# EasyEDA Pro project ProPrj_stmf4+esp32s3转接板_2025-01-29.epro, board PCB2
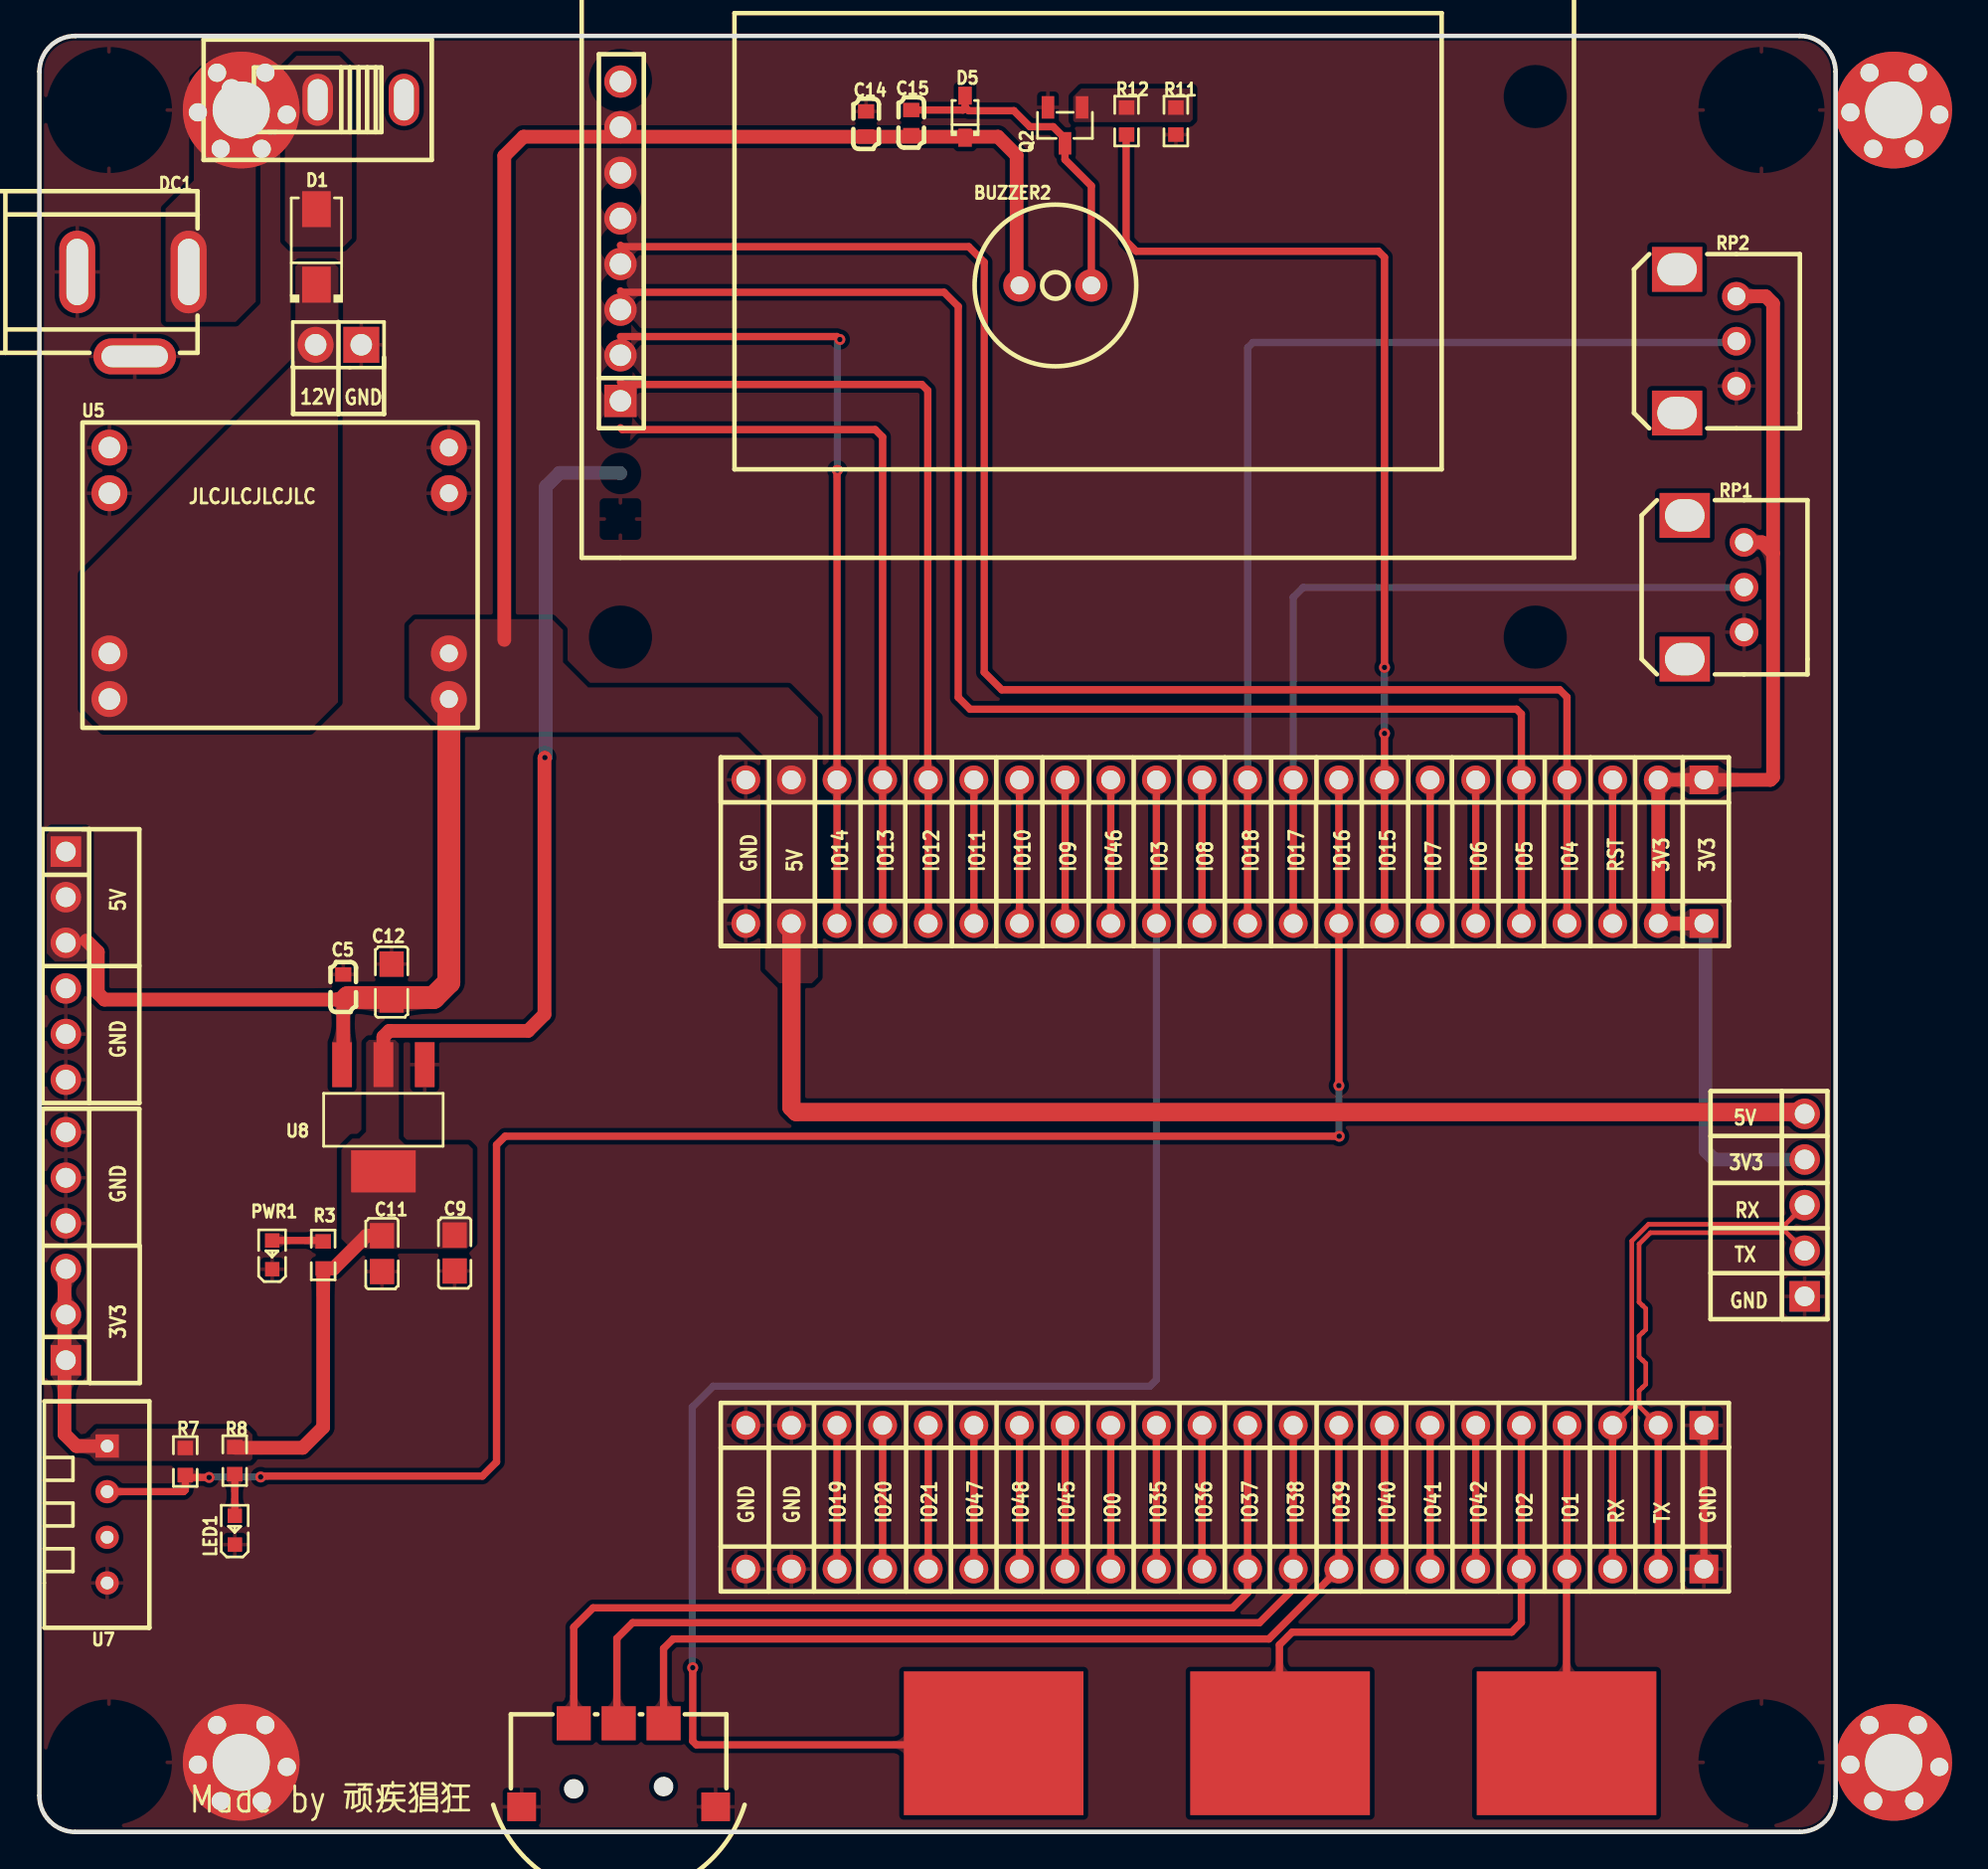
[diagram p4: board, top side]
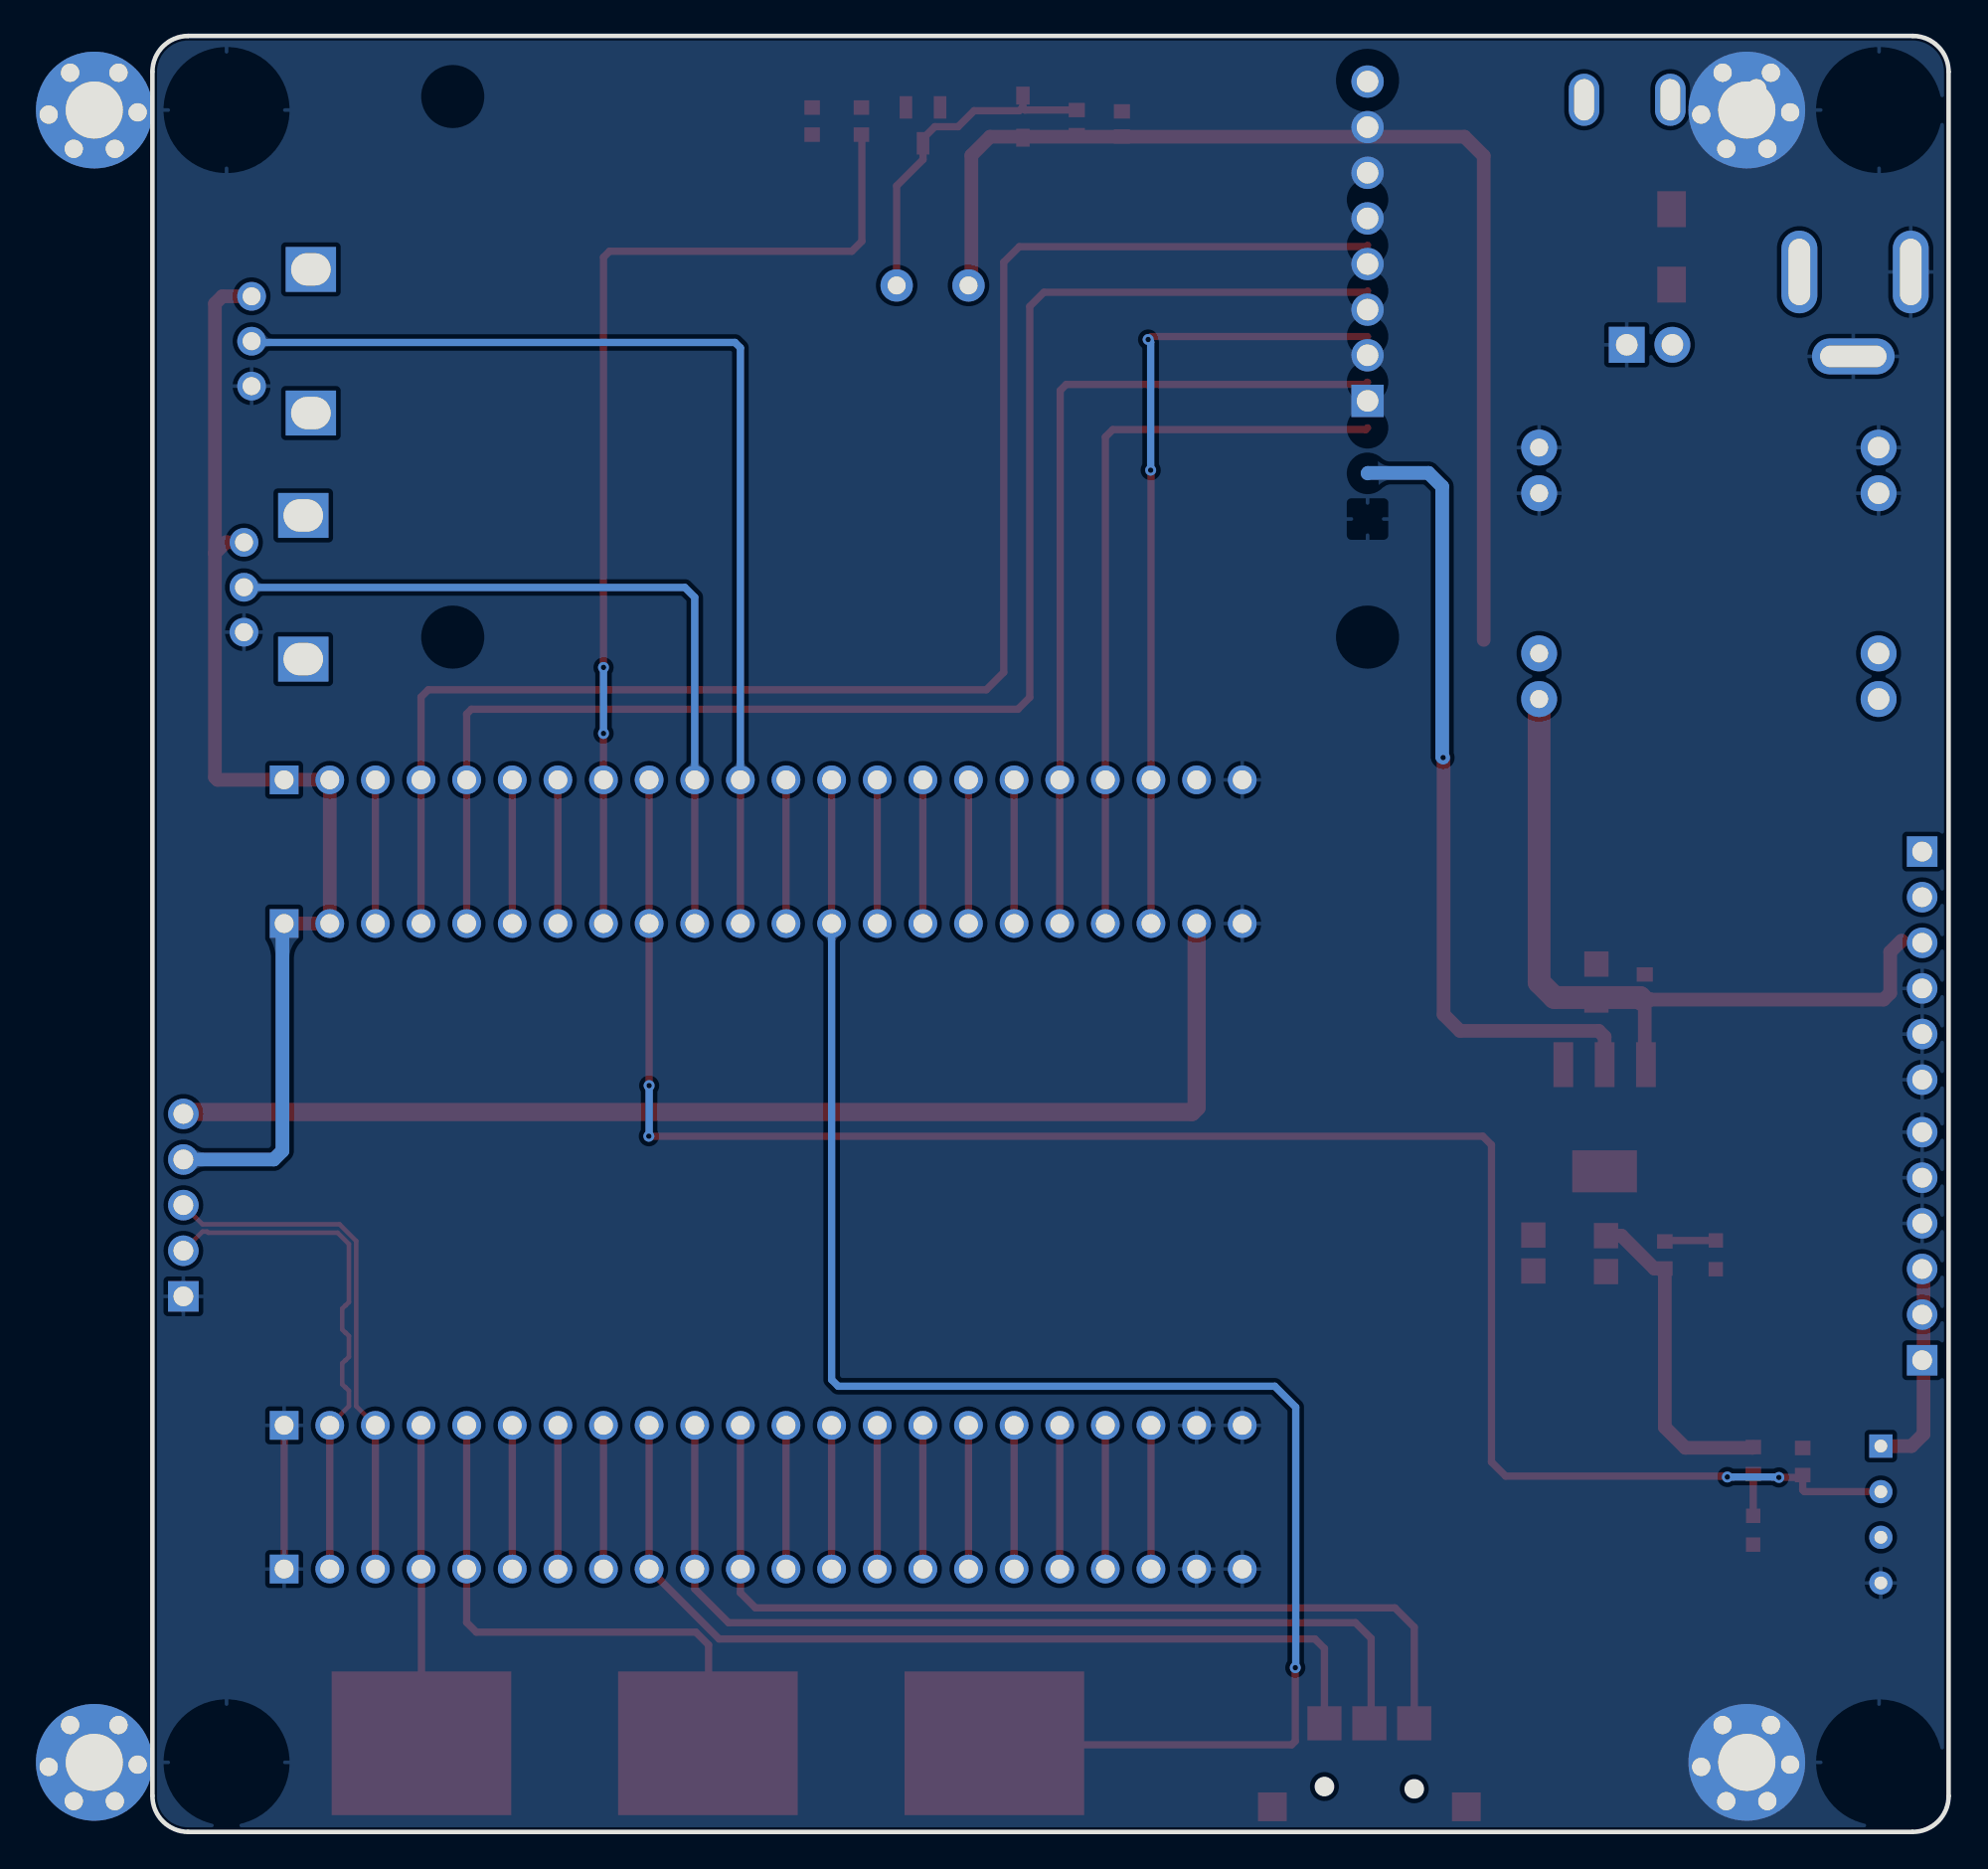
[diagram p5: board, bottom side, seen from below]

Outline 100 x 100 mm; copper layers: Top Layer, Bottom Layer. Coordinates in mm from the lower left corner of the outline.
Outline path: 0,98 0,2 arc(0.59,0.59) 2,0 98,0 arc(99.41,0.59) 100,2 100,98 arc(99.41,99.41) 98,100 2,100 arc(0.59,99.41) 0,98
Stack: Top Layer 0.035mm / Dielectric1 1.51mm FR4 er 4.5 / Bottom Layer 0.035mm

## Design rules (mm)
net TX: DP1
net RX: DP1
template: 自定义配置
spacing copperThickness1oz (default): track to track 0.102, other pairs 0.152 to 0.3
spacing copperThickness2oz: track to track 0.203, other pairs 0.152 to 0.3
track width copperThickness1oz (default): min 0.254, default 0.406, max 2.54
track width copperThickness2oz: min 0.203, default 0.254, max 2.54
track width PWR: min 0.508, default 0.762, max 2.54
differential pair differentialPair (default): width min 0.127, default 0.254, max 2.54; gap min 0.152, default 0.152
via viaSize (default): diameter min 0.5, default 0.61, max 10; hole min 0.3, default 0.305, max 6.299
net 12V uses PWR
net 3V3 uses PWR
net 5V uses PWR

## Placement (name value [footprint] x y rotation side)
BUZZER2  2.7kHz  [BUZ-TH_BD9.0-P4.00-D0.6-FD]  56.57 86.11 0 top
C5  100nF  [C0603]  16.92 47.04 270 top
C9  100nF  [C0805]  23.12 32.23 90 top
C11  10uf  [C0805]  19.07 32.2 90 top
C12  10uf  [C0805]  19.61 47.32 270 top
C14  100nF  [C0603]  46.02 95.1 270 top
C15  100nF  [C0603]  48.54 95.17 270 top
D1  SS34  [SMA_L4.3-W2.5-LS5.0-RD]  15.42 88.25 90 top
D5  1N4148WS-E  [SOD-323_L1.8-W1.3-LS2.5-RD]  51.54 95.5 90 top
DC1  DC005  [DC-IN-TH_DC005]  5.21 84.51 0 top
H4  PZ254V-11-02P  [HDR-TH_2P-P2.54-V-M]  16.65 82.8 180 top
H5  PZ254V-11-05P  [HDR-TH_5P-P2.54-V-M]  98.28 34.9 90 top
H6  PZ254V-11-06P  [HDR-TH_6P-P2.54-V-M]  1.47 48.23 270 top
H7  PZ254V-11-06P  [HDR-TH_6P-P2.54-V-M]  1.47 32.61 90 top
K1  -  [125 X 300]  95.87 3.87 0 top
K2  -  [125 X 300]  3.87 95.87 0 top
K3  -  [125 X 300]  95.87 95.87 0 top
K4  -  [125 X 300]  3.87 3.87 0 top
KEY1  -  [ESP32触摸引脚焊盘]  89.02 2.44 90 top
KEY2  -  [ESP32触摸引脚焊盘]  73.07 2.44 90 top
KEY3  -  [ESP32触摸引脚焊盘]  49.13 7.44 270 top
LED1  -  [LED_0603]  10.87 16.85 90 top
ON/OFF1  SS12D10G5  [SW-TH_SHOU-HAN_SS12D10G4]  15.49 96.44 180 top
PWR1  -  [LED_0603]  12.95 32.18 90 top
Q2  SS8050  [SOT-23-3_L2.9-W1.3-P1.90-LS2.4-BR]  57.1 95.02 90 top
R3  3.3kΩ  [R0603]  15.8 32.12 270 top
R7  4.7k  [R0603]  8.12 20.62 90 top
R8  1k  [R0603]  10.87 20.67 90 top
R11  10K  [R0603]  63.27 95.26 90 top
R12  1K  [R0603]  60.53 95.26 270 top
RP1  -  [卧式电位器]  94.9 69.3 90 top
RP2  -  [卧式电位器]  94.48 83 90 top
U1  ZX-PM2.54-1-22PY  [HDR-TH_22P-P2.54-V-F]  66 50.58 180 top
U2  ZX-PM2.54-1-22PY  [HDR-TH_22P-P2.54-V-F]  66 22.64 180 top
U3  ZX-PM2.54-1-22PY  [HDR-TH_22P-P2.54-V-F]  66 14.64 180 top
U4  ZX-PM2.54-1-22PY  [HDR-TH_22P-P2.54-V-F]  66 58.58 180 top
U5  MP1584EN模块  [MP1548EN可调电源模块]  2.4 78.48 0 top
U6  -  [1.8寸TFT屏幕]  32.35 73.1 90 top
U7  DHT11  [SENSOR-TH_DHT11]  3.77 17.67 270 top
U8  AMS1117-3.3  [SOT-223-3_L6.5-W3.4-P2.30-LS7.0-BR]  19.15 39.75 90 top
U9  QS-301-AGS5P  [SW-SMD_QS-301-AGS5P]  32.25 3.72 180 top

## Footprints (pads in the part's own frame, mm; a bottom-side part is the same pattern mirrored in y, then rotated)
1.8寸TFT屏幕
  round 1.8 hole 1.2: BLK(24.358,0) CS(21.818,0) DC(19.278,0) RST(16.738,0) SCL(11.658,0) SDA(14.198,0) VDD(9.118,0)
  rect 1.8x1.8 hole 1.2: GND(6.578,0)
125 X 300
  round 1.016 hole 1.021x1.016: 1(4.95,-0.127) 1(6.017,2.078) 1(6.22,-2.159) 1(8.506,-2.159) 1(8.71,2.078) 1(9.903,-0.254)
  round 6.5 hole 3.18x3.175: 1(7.363,0)
BUZ-TH_BD9.0-P4.00-D0.6-FD
  round 1.8 hole 1: 1(-2,0) 2(2,0)
C0603
  rect 0.8x0.9 smd: 1(-0.7,0) 2(0.7,0)
C0805
  rect 1.41x1.35 smd: 1(-1,0) 2(1,0)
DC-IN-TH_DC005
  oval 2x4.6 hole 1.2x3.7: 1(3.1,2.35) 2(-3.1,2.35)
  oval 4.6x2 hole 3.7x1.2: 3(0.1,-2.35)
ESP32触摸引脚焊盘
  rect 8x10 smd: 1(2.5,4)
HDR-TH_2P-P2.54-V-M
  rect 2x2 hole 1.2: 1(-1.27,0)
  round 2 hole 1.2: 2(1.27,0)
HDR-TH_5P-P2.54-V-M
  rect 1.7x1.7 hole 1.1: 1(-5.08,0)
  round 1.7 hole 1.1: 2(-2.54,0) 3(0,0) 4(2.54,0) 5(5.08,0)
HDR-TH_6P-P2.54-V-M
  rect 1.7x1.7 hole 1.1: 1(-6.35,0)
  round 1.7 hole 1.1: 2(-3.81,0) 3(-1.27,0) 4(1.27,0) 5(3.81,0) 6(6.35,0)
HDR-TH_22P-P2.54-V-F
  rect 1.6x1.6 hole 1.05: 1(-26.67,0)
  round 1.6 hole 1.05: 2(-24.13,0) 3(-21.59,0) 4(-19.05,0) 5(-16.51,0) 6(-13.97,0) 7(-11.43,0) 8(-8.89,0) 9(-6.35,0) 10(-3.81,0) 11(-1.27,0) 12(1.27,0) 13(3.81,0) 14(6.35,0) 15(8.89,0) 16(11.43,0) 17(13.97,0) 18(16.51,0) 19(19.05,0) 20(21.59,0) 21(24.13,0) 22(26.67,0)
LED_0603
  rect 0.8x0.8 smd: 1(-0.851,-0.01) 2(0.75,-0.005)
MP1548EN可调电源模块
  round 2 hole 1.2: 1(1.5,-1.4) 2(1.5,-3.94) 3(1.5,-12.86) 4(1.5,-15.4)
  round 2 hole 1: 5(20.4,-15.4) 6(20.4,-12.86) 7(20.4,-3.94) 8(20.4,-1.4)
R0603
  rect 0.806x0.864 smd: 1(-0.753,0) 2(0.753,0)
SENSOR-TH_DHT11
  rect 1.296x1.296 hole 0.711: 1(-3.81,0)
  round 1.296 hole 0.711: 2(-1.27,0) 3(1.27,0) 4(3.81,0)
SMA_L4.3-W2.5-LS5.0-RD
  rect 2x1.593 smd: 1(-2.1,0) 2(2.1,0)
SOD-323_L1.8-W1.3-LS2.5-RD
  rect 1x0.75 smd: 1(-1.173,0) 2(1.173,0)
SOT-23-3_L2.9-W1.3-P1.90-LS2.4-BR
  rect 1.25x0.7 smd: 1(1,-0.95) 2(1,0.95) 3(-1,0)
SOT-223-3_L6.5-W3.4-P2.30-LS7.0-BR
  rect 2.5x1.1 smd: 1(2.97,-2.3) 2(2.97,0) 3(2.97,2.3)
  rect 2.34x3.6 smd: 4(-2.97,0)
SW-SMD_QS-301-AGS5P
  rect 1.9x1.9 smd: 1(-2.5,-2.325) 2(0,-2.325) 3(2.5,-2.325)
  rect 1.6x1.6 smd: 4(5.4,2.325) 5(-5.4,2.325)
SW-TH_SHOU-HAN_SS12D10G4
  oval 1.7x2.9 hole 1.1x2.3: 1(-4.8,0) 2(0,0) 3(4.8,0)
卧式电位器
  round 1.6 hole 1: 1(-2.5,0) 2(0,0) 3(2.5,0)
  rect 2.5x2.8 hole 1.8x2.2: 4(-4,3.3) 5(4,3.3)

## Nets
As in the schematic.

Pads without a net: ON/OFF1 1; RP1 4 5; RP2 4 5; U6 BLK; U7 3

## Via types
v1: diameter 0.61, hole 0.305, Top Layer to Bottom Layer, 10 vias

## Routing (per net, layer and track width the routed paths; a pad name or vN(x,y) marks a point on that pad's centre or on a via; arc(x,y) is an arc through that point)
3V3: length 141.1
  Top Layer w0.762: RP1.3 94.91,71.81 95.91,71.81 96.52,71.2 ; RP2.3 96.11,85.5 96.52,85.09 96.52,71.2 ; H7.3 1.4,31.27 1.4,22.15 2.06,21.48 U7.1 ; 90.41,50.58 90.13,50.86 U4.2 U4.1 96.37,58.58 96.52,58.72 96.52,71.2 ; 90.41,50.58 U1.2 ; 90.41,50.58 U1.1 ; v1(28.14,59.82) 28.12,59.79 28.12,45.52 27.2,44.6 19.48,44.6 19.15,44.27 U8.2 ; C11.2 18.21,33.2 16.38,31.37 15.8,31.37 15.8,22.53 14.66,21.39 10.91,21.39 R8.2
  Bottom Layer w0.762: U1.1 92.76,50.48 92.76,37.92 93.24,37.44 H5.4 ; v1(28.14,59.82) 28.19,59.87 28.19,74.9 28.96,75.67 32.32,75.67 32.35,75.64
5V: length 173.4
  Top Layer w0.762: 25.88,66.37 25.88,93.32 26.95,94.39 53.37,94.39 54.41,93.34 54.41,85.91 54.59,85.72 ; 2.62,49.63 3.25,49 3.25,46.71 3.62,46.34 C5.2 16.92,42.79 U8.3
  Top Layer w1.016: H5.5 98.18,40.08 42.14,40.08 41.87,40.35 U1.21
  Top Layer w1.27: 17.07,46.34 17.18,46.46 21.95,46.46 22.8,47.31 22.8,63.08
GND: length 8
  Top Layer w0.406: U2.1 U3.1
IO0: length 8
  Top Layer w0.406: U2.14 U3.14
IO1: length 17.7
  Top Layer w0.406: U2.4 U3.4 85.02,14.61 KEY1.1
IO2: length 30.5
  Top Layer w0.406: KEY2.1 69.04,4.97 69.04,10.41 69.75,11.12 81.97,11.12 82.51,11.67 U3.5 U2.5
IO3: length 95.3
  Top Layer w0.406: U4.13 U1.13 ; v1(36.37,9.14) 36.37,5.05 36.58,4.85 53.04,4.85 KEY3.1
  Bottom Layer w0.406: U1.13 62.19,25.18 61.82,24.82 37.52,24.82 36.35,23.65 36.35,9.17 v1(36.37,9.14)
IO4: length 89.1
  Top Layer w0.406: 32.35,88.34 32.43,88.26 51.74,88.26 52.6,87.4 52.6,64.57 53.58,63.59 84.64,63.59 85.05,63.19 U4.4 U1.4
IO5: length 84.3
  Top Layer w0.406: U1.5 U4.5 82.51,62.25 82.25,62.51 51.82,62.51 51.16,63.17 51.16,84.94 50.37,85.72 32.43,85.72 32.35,85.8
IO6: length 8
  Top Layer w0.406: U4.6 U1.6
IO7: length 8
  Top Layer w0.406: U4.7 U1.7
IO8: length 8
  Top Layer w0.406: U4.12 U1.12
IO9: length 8
  Top Layer w0.406: U4.15 U1.15
IO10: length 8
  Top Layer w0.406: U4.16 U1.16
IO11: length 8
  Top Layer w0.406: U4.17 U1.17
IO12: length 47
  Top Layer w0.406: U1.18 U4.18 49.46,58.6 49.46,80.26 49.12,80.59 32.48,80.59 32.35,80.72
IO13: length 41.9
  Top Layer w0.406: 32.35,78.18 32.45,78.08 46.53,78.08 46.95,77.67 U4.19 U1.19
IO14: length 44.8
  Top Layer w0.406: U1.20 U4.20 44.41,75.8 ; 32.35,83.26 44.4,83.26 v1(44.56,83.1)
  Bottom Layer w0.406: v1(44.56,83.1) 44.42,82.96 v1(44.42,75.82)
IO15: length 57.8
  Top Layer w0.406: R12.2 60.5,94.48 60.5,88.57 61.06,88.01 74.55,88.01 74.89,87.67 v1(74.89,64.84) ; U1.8 U4.8 v1(74.89,61.16)
  Bottom Layer w0.406: v1(74.89,61.16) v1(74.89,64.84)
IO16: length 107.6
  Top Layer w0.406: v1(9.45,19.74) 8.26,19.74 R7.1 8.12,19.05 8.03,18.95 3.78,18.95 U7.2 ; U4.9 U1.9 v1(72.35,41.55) ; v1(72.36,38.73) 25.93,38.73 25.45,38.25 25.45,20.6 24.66,19.81 12.37,19.81 v1(12.32,19.76)
  Bottom Layer w0.406: v1(72.35,41.55) 72.35,38.75 v1(72.36,38.73) ; v1(12.32,19.76) 9.47,19.76 v1(9.45,19.74)
IO17: length 43.5
  Top Layer w0.406: U4.10 U1.10
  Bottom Layer w0.406: U4.10 69.81,68.74 70.36,69.29 94.89,69.29 RP1.2
IO18: length 59.4
  Top Layer w0.406: U4.11 U1.11
  Bottom Layer w0.406: RP2.2 94.41,82.93 67.56,82.93 67.27,82.63 U4.11
IO19: length 8
  Top Layer w0.406: U2.20 U3.20
IO20: length 8
  Top Layer w0.406: U2.19 U3.19
IO21: length 8
  Top Layer w0.406: U2.18 U3.18
IO35: length 8
  Top Layer w0.406: U3.13 U2.13
IO36: length 8
  Top Layer w0.406: U2.12 U3.12
IO37: length 53
  Top Layer w0.406: U2.11 U3.11 67.27,13.31 66.43,12.47 30.82,12.47 29.75,11.4 29.75,6.05
IO38: length 52.7
  Top Layer w0.406: U2.10 U3.10 69.81,13.53 67.93,11.65 33.02,11.65 32.15,10.77 32.15,6.15 32.25,6.05
IO39: length 51.6
  Top Layer w0.406: U2.9 U3.9 68.45,10.74 35.28,10.74 34.75,10.21 34.75,6.05
IO40: length 8
  Top Layer w0.406: U2.8 U3.8
IO41: length 8
  Top Layer w0.406: U2.7 U3.7
IO42: length 8
  Top Layer w0.406: U2.6 U3.6
IO45: length 8
  Top Layer w0.406: U2.15 U3.15
IO46: length 8
  Top Layer w0.406: U4.14 U1.14
IO47: length 8
  Top Layer w0.406: U2.17 U3.17
IO48: length 8
  Top Layer w0.406: U2.16 U3.16
RST: length 8
  Top Layer w0.406: U4.3 U1.3
RX: length 29.2
  Top Layer w0.254: U2.3 88.65,23.7 88.65,32.9 89.59,33.83 97.21,33.83 H5.3
  Top Layer w0.406: U2.3 U3.3
TX: length 29.1
  Top Layer w0.254: H5.2 97.21,33.43 96.96,33.43 96.89,33.36 89.69,33.36 89.06,32.73 89.06,29.5 89.24,29.32 89.25,29.32 89.43,29.14 89.43,27.97 89.25,27.79 89.24,27.79 89.06,27.61 89.06,26.45 89.24,26.27 89.25,26.27 89.43,26.09 89.43,24.92 89.25,24.75 89.24,24.75 89.06,24.57 89.06,23.7 U2.2
  Top Layer w0.406: U2.2 U3.2
$1N5680: length 2.3
  Top Layer w0.406: 10.88,17.6 10.88,19.92 R8.1
$1N6077: length 2.9
  Top Layer w0.406: PWR1.2 15.75,32.93 R3.1
$1N10279: length 18.8
  Top Layer w0.406: 51.56,96.01 51.42,95.87 48.54,95.87 ; 51.56,96.01 51.74,95.83 54.25,95.83 55.14,94.94 56.44,94.94 57.1,94.28 Q2.3 57.1,93.12 58.57,91.65 BUZZER2.2 ; 51.56,96.01 51.54,96.04 D5.2

## Copper pours and planes (outline as drawn; the poured copper is in the pictures)
3V3 on Top Layer: 16.81,44.1 24.13,44.1 24.13,32.46 16.81,32.46
3V3 on Top Layer: 2.84,22.46 11.86,22.46 11.86,20.65 2.84,20.65
5V on Top Layer: 20.57,67.53 43.35,67.53 43.35,47.25 20.57,47.25
5V on Top Layer: 0.41,55.83 2.77,55.83 2.77,48.46 0.41,48.46
12V on Top Layer: 14.25,87.37 16.65,87.37 16.65,81.53 14.25,81.53
12V on Top Layer: 2.4,81.88 16.65,81.88 16.65,61.35 2.4,61.35
GND on Top Layer: -24.41,113.21 115.98,113.21 115.98,-6.99 -24.41,-6.99
GND on Bottom Layer: -14.81,111.15 109.47,111.15 109.47,-4.57 -14.81,-4.57
$1N4171 on Top Layer: 7.02,98.3 12.05,98.3 12.05,84.08 7.02,84.08
$1N4173 on Top Layer: 13.67,98.9 17.4,98.9 17.4,88.25 13.67,88.25
$1N10277 on Top Layer: 57.55,97.08 64.21,97.08 64.21,95.2 57.55,95.2

Small or netless copper shapes (teardrops, artwork), in the pictures only: 147 on Top Layer, 17 on Bottom Layer

## Text on the board
Top Silkscreen Layer: JLCJLCJLCJLC | 12V | GND | 3V3 | 5V | TX | RX | IO19 | IO14 | IO20 | IO13 | IO21 | IO12 | IO47 | IO11 | IO48 | IO10 | IO45 | IO9 | IO0 | IO46 | IO35 | IO3 | IO36 | IO8 | IO37 | IO18 | IO38 | IO17 | IO39 | IO16 | IO40 | IO15 | IO41 | IO7 | IO6 | IO42 | IO5 | IO2 | IO4 | IO1 | RST | Made by 顽疾猖狂
